# Altium schematic sheet MCU.SchDoc
size A3
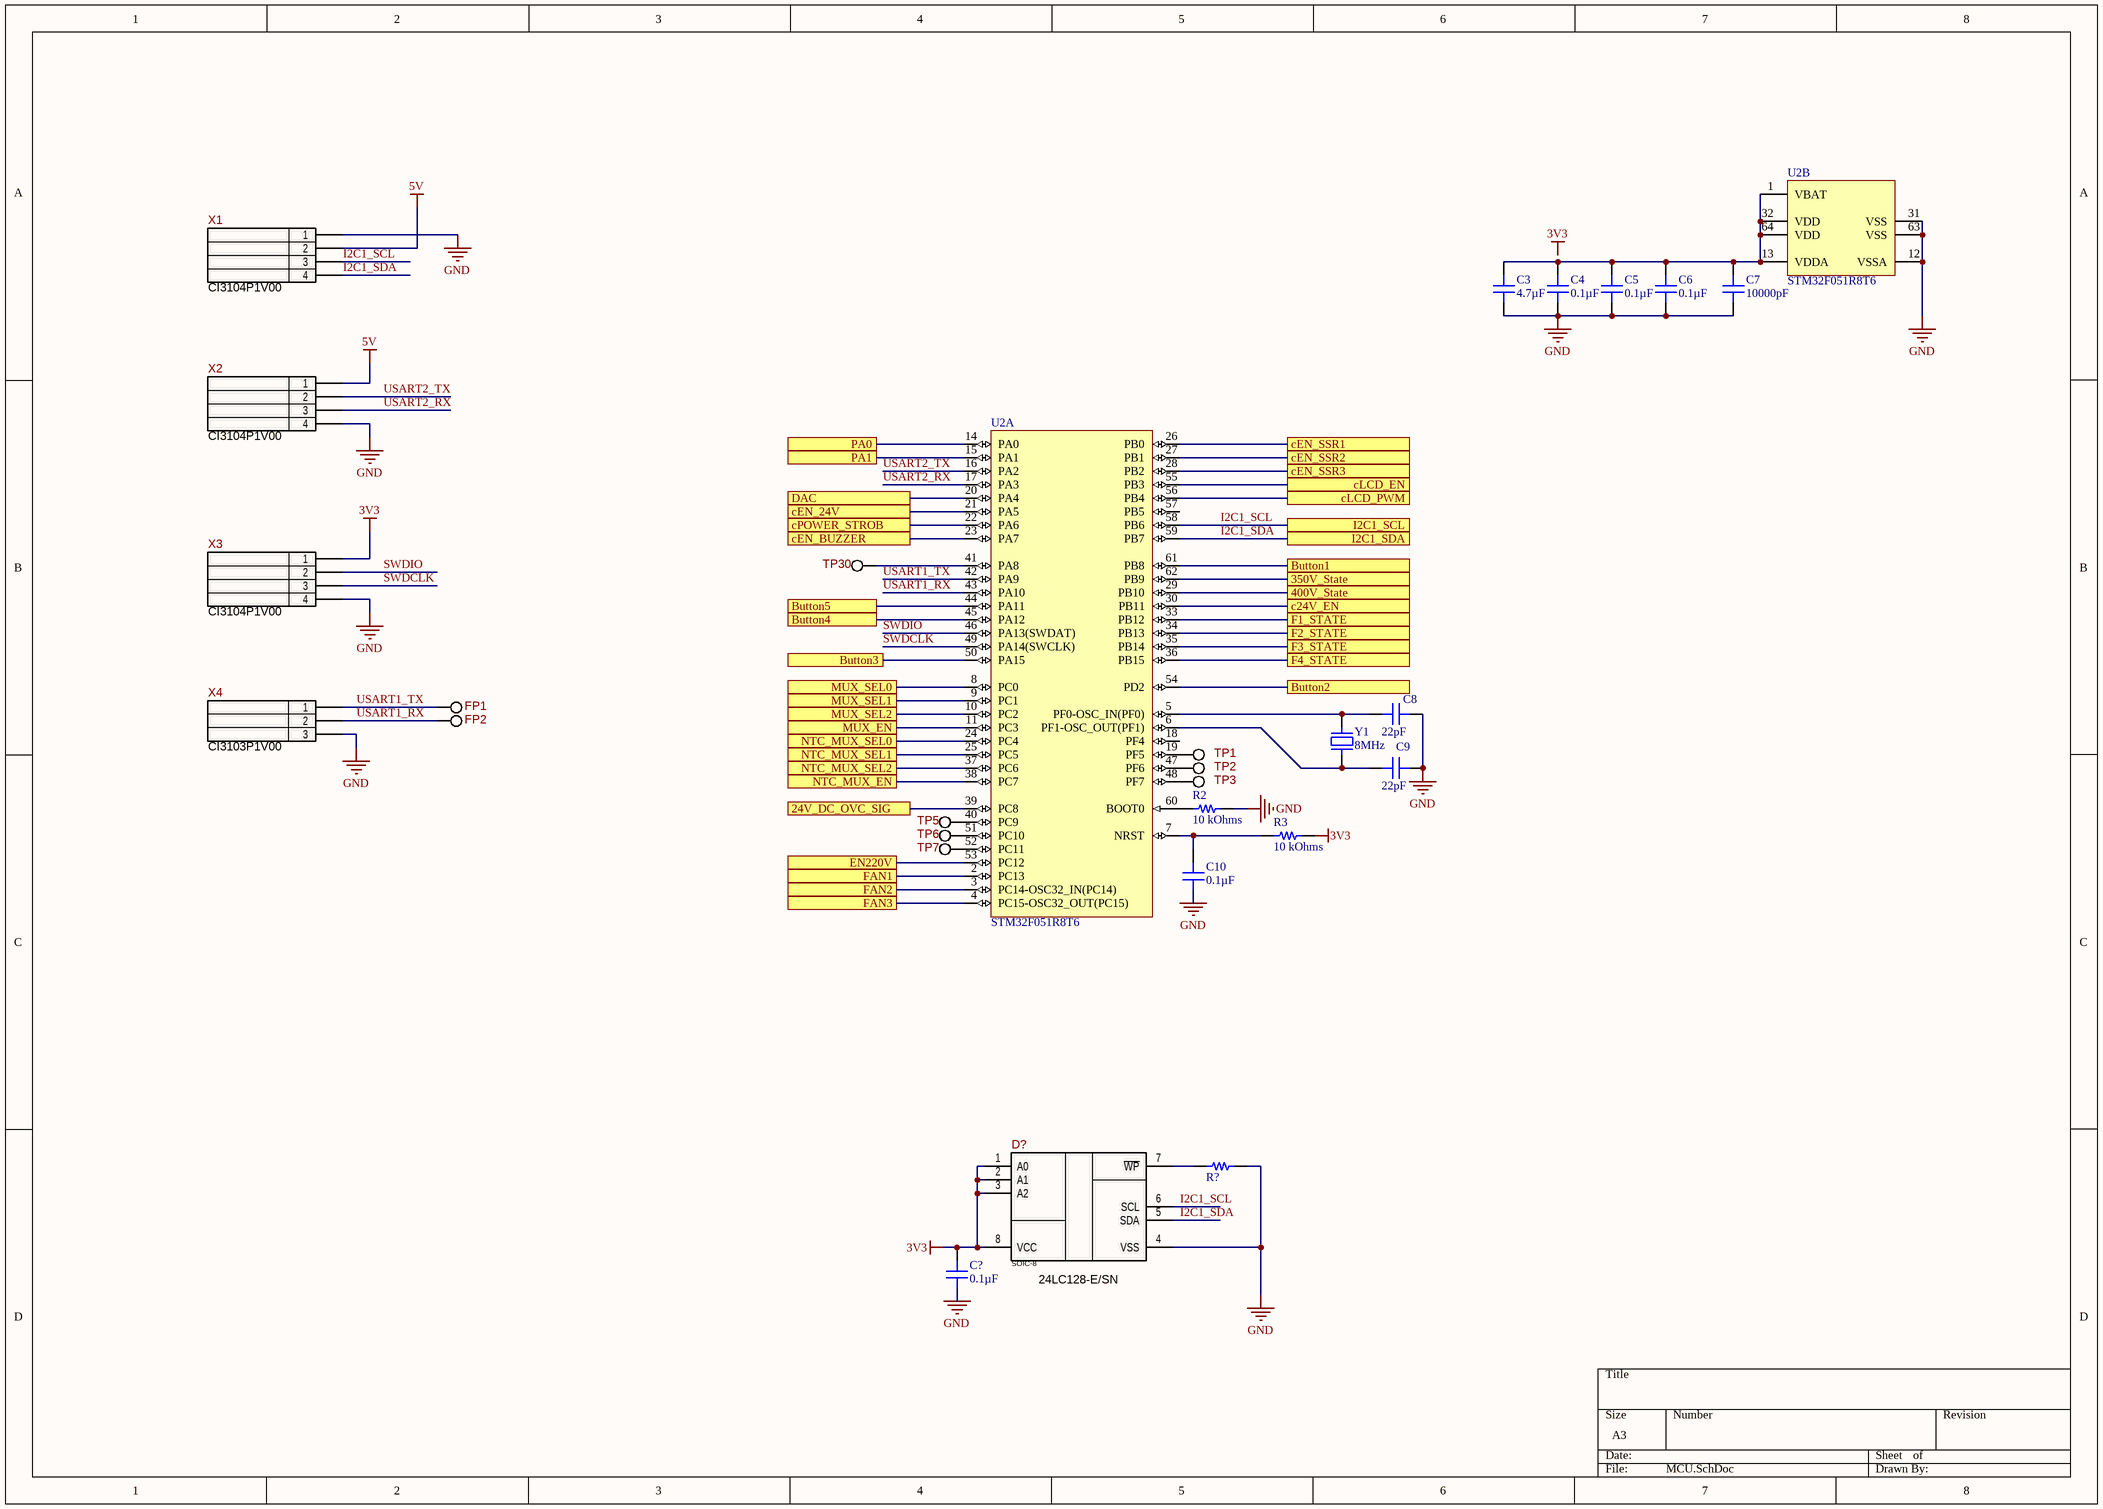
[diagram p0: MCU.SchDoc]

## Parts
C3  4.7µF  [CAP 0805_2012]
C4  0.1µF  [CAP 0805_2012]
C5  0.1µF  [CAP 0805_2012]
C6  0.1µF  [CAP 0805_2012]
C7  10000pF  [CAP 0805_2012]
C8  22pF  [CAP 0805_2012]
C9  22pF  [CAP 0805_2012]
C10  0.1µF  [CAP 0805_2012]
C?  0.1µF  [CAP 0805_2012]
D?  Package: SOIC-8  [SOIC-8_W3.9MM]  (hidden comment: 24LC128-E/SN)
FP1  PAD-1.1mm  [PAD-1.1mm]  (value not drawn)  (no BOM)
FP2  PAD-1.1mm  [PAD-1.1mm]  (value not drawn)  (no BOM)
R2  10 kOhms  [RES 0805_2012]
R3  10 kOhms  [RES 0805_2012]
R?  (no value)  [RES 0805_2012]
TP1  PAD-1.1mm  [PAD-1.1mm]  (value not drawn)  (no BOM)
TP2  PAD-1.1mm  [PAD-1.1mm]  (value not drawn)  (no BOM)
TP3  PAD-1.1mm  [PAD-1.1mm]  (value not drawn)  (no BOM)
TP5  PAD-1.1mm  [PAD-1.1mm]  (value not drawn)  (no BOM)
TP6  PAD-1.1mm  [PAD-1.1mm]  (value not drawn)  (no BOM)
TP7  PAD-1.1mm  [PAD-1.1mm]  (value not drawn)  (no BOM)
TP30  PAD-1.1mm  [PAD-1.1mm]  (value not drawn)  (no BOM)
U2  STM32F051R8T6  [STM-LQFP64_L]  (parts A,B of 2)
X1  WH-04S  [WF-4S]  (value not drawn)
X2  WH-04S  [WF-4S]  (value not drawn)
X3  WH-04S  [WF-4S]  (value not drawn)
X4  WH-03S  [WF-3S]  (value not drawn)
Y1  8MHz  [ABRACON ABLS]

## Ports
24V_DC_OVC_SIG, 350V_State, 400V_State, Button1, Button2, Button3, Button4, Button5, c24V_EN, cEN_24V, cEN_BUZZER, cEN_SSR1, cEN_SSR2, cEN_SSR3, cLCD_EN, cLCD_PWM, cPOWER_STROB, DAC, EN220V, F1_STATE, F2_STATE, F3_STATE, F4_STATE, FAN1, FAN2, FAN3, I2C1_SCL, I2C1_SDA, MUX_EN, MUX_SEL0, MUX_SEL1, MUX_SEL2, NTC_MUX_EN, NTC_MUX_SEL0, NTC_MUX_SEL1, NTC_MUX_SEL2, PA0, PA1

## Nets
3V3: C?.1 D?.1(A0) D?.2(A1) D?.3(A2) D?.8(VCC) R3.2 X3.1
5V: X1.2 X2.1
GND: C3.1 C4.1 C5.1 C6.1 C7.1 C8.2 C9.2 C10.1 C?.2 D?.4(VSS) R2.2 R?.2 U2.12(VSSA) U2.31(VSS) U2.63(VSS) X1.1 X2.4 X3.4 X4.3
24V_DC_OVC_SIG: U2.39(PC8) ; port 24V_DC_OVC_SIG
350V_State: U2.62(PB9) ; port 350V_State
400V_State: U2.29(PB10) ; port 400V_State
Button1: U2.61(PB8) ; port Button1
Button2: U2.54(PD2) ; port Button2
Button3: U2.50(PA15) ; port Button3
Button4: U2.45(PA12) ; port Button4
Button5: U2.44(PA11) ; port Button5
c24V_EN: U2.30(PB11) ; port c24V_EN
cEN_24V: U2.21(PA5) ; port cEN_24V
cEN_BUZZER: U2.23(PA7) ; port cEN_BUZZER
cEN_SSR1: U2.26(PB0) ; port cEN_SSR1
cEN_SSR2: U2.27(PB1) ; port cEN_SSR2
cEN_SSR3: U2.28(PB2) ; port cEN_SSR3
cLCD_EN: U2.55(PB3) ; port cLCD_EN
cLCD_PWM: U2.56(PB4) ; port cLCD_PWM
cPOWER_STROB: U2.22(PA6) ; port cPOWER_STROB
DAC: U2.20(PA4) ; port DAC
EN220V: U2.53(PC12) ; port EN220V
F1_STATE: U2.33(PB12) ; port F1_STATE
F2_STATE: U2.34(PB13) ; port F2_STATE
F3_STATE: U2.35(PB14) ; port F3_STATE
F4_STATE: U2.36(PB15) ; port F4_STATE
FAN1: U2.2(PC13) ; port FAN1
FAN2: U2.3(PC14-OSC32_IN(PC14)) ; port FAN2
FAN3: U2.4(PC15-OSC32_OUT(PC15)) ; port FAN3
I2C1_SCL: D?.6(SCL) U2.58(PB6) X1.3 ; port I2C1_SCL
I2C1_SDA: D?.5(SDA) U2.59(PB7) X1.4 ; port I2C1_SDA
MUX_EN: U2.11(PC3) ; port MUX_EN
MUX_SEL0: U2.8(PC0) ; port MUX_SEL0
MUX_SEL1: U2.9(PC1) ; port MUX_SEL1
MUX_SEL2: U2.10(PC2) ; port MUX_SEL2
NTC_MUX_EN: U2.38(PC7) ; port NTC_MUX_EN
NTC_MUX_SEL0: U2.24(PC4) ; port NTC_MUX_SEL0
NTC_MUX_SEL1: U2.25(PC5) ; port NTC_MUX_SEL1
NTC_MUX_SEL2: U2.37(PC6) ; port NTC_MUX_SEL2
PA0: U2.14(PA0) ; port PA0
PA1: U2.15(PA1) ; port PA1
SWDCLK: U2.49(PA14(SWCLK)) X3.3
SWDIO: U2.46(PA13(SWDAT)) X3.2
USART1_RX: FP2.1 U2.43(PA10) X4.2
USART1_TX: FP1.1 U2.42(PA9) X4.1
USART2_RX: U2.17(PA3) X2.3
USART2_TX: U2.16(PA2) X2.2
NetC3_2: C3.2 C4.2 C5.2 C6.2 C7.2 U2.1(VBAT) U2.13(VDDA) U2.32(VDD) U2.64(VDD)
NetC8_1: C8.1 U2.5(PF0-OSC_IN(PF0)) Y1.2
NetC9_1: C9.1 U2.6(PF1-OSC_OUT(PF1)) Y1.1
NetC10_2: C10.2 R3.1 U2.7(NRST)
NetD?_7: D?.7(~{WP}) R?.1
NetR2_1: R2.1 U2.60(BOOT0)
NetTP1_1: TP1.1 U2.19(PF5)
NetTP2_1: TP2.1 U2.47(PF6)
NetTP3_1: TP3.1 U2.48(PF7)
NetTP5_1: TP5.1 U2.40(PC9)
NetTP6_1: TP6.1 U2.51(PC10)
NetTP7_1: TP7.1 U2.52(PC11)
NetTP30_1: TP30.1 U2.41(PA8)

Not connected (* = marked no-connect by the designer): U2 18(PF4) 57(PB5)

## Notes on the sheet
- Labels drawn without touching a wire or pin: 3V3

## Library data of the parts
C3 = CGA4J1X8L1C475K125AC: CAP CER X8L 16V 4.7UF 10% 1.25MM; Manufacturer: TDK Corporation; Part Number: CGA4J1X8L1C475K125AC; Value: 4.7µF; Applications: Automotive; Capacitance: 4.7µF; ComponentLink1Description: Datasheet; ComponentLink1URL: https://product.tdk.com/info/en/catalog/datasheets/mlcc_automotive_hightemp_en.pdf?ref_disty=digikey; ComponentLink2Description: DigiKey Link; ComponentLink2URL: http://digikey.com/product-detail/en/tdk-corporation/CGA4J1X8L1C475K125AC/445-175266-1-ND/7930961; Device Package: 0805 (2012 Metric); Features: High Temperature; LastUpdated: 02.09.2020 01:04:37; Lifecycle Status: Active; Minimum Order: 1; Mounting Type: Surface Mount, MLCC; Operating Temperature: -55°C ~ 150°C; Package / Case: 0805 (2012 Metric); Packaging: TapeAndReel; PartId: 5098; Part Status: Active; Price: 0.14; Ratings: AEC-Q200; Series: CGA; Size / Dimension: 0.079" L x 0.049" W (2.00mm x 1.25mm); Supplier 1: DigiKey; Supplier Part Number 1: 445-175266-1-ND; Temperature Coefficient: X8L; Thickness (Max): 0.057" (1.45mm); Tolerance: ±10%; Voltage - Rated: 16V
C4-C6 C10 C? = CC0805MRX7R9BB104: CAP CER 0.1UF 50V X7R 0805; Manufacturer: Yageo; Tolerance: ±20%; Part Number: CC0805MRX7R9BB104; Value: 0.1µF; Applications: General Purpose; Capacitance: 0.1µF; ComponentLink1Description: Datasheet; ComponentLink1URL: https://www.yageo.com/upload/media/product/productsearch/datasheet/mlcc/UPY-GPHC_X7R_6.3V-to-50V_18.pdf; ComponentLink2Description: DigiKey Link; ComponentLink2URL: http://digikey.com/product-detail/en/yageo/CC0805MRX7R9BB104/311-4351-1-ND/8025440; Device Package: 0805 (2012 Metric); LastUpdated: 02.09.2020 01:04:42; Lifecycle Status: Active; Minimum Order: 1; Mounting Type: Surface Mount, MLCC; Operating Temperature: -55°C ~ 125°C; Package / Case: 0805 (2012 Metric); Packaging: TapeAndReel; PartId: 2475; Part Status: Active; Price: 0.02; Series: CC; Size / Dimension: 0.079" L x 0.049" W (2.00mm x 1.25mm); Supplier 1: DigiKey; Supplier Part Number 1: 311-4351-1-ND; Temperature Coefficient: X7R; Thickness (Max): 0.037" (0.95mm); Voltage - Rated: 50V
C7 = C0805C103K5RECAUTO: CAP CER 0805 10NF 50V X7R 10%; Manufacturer: KEMET; Part Number: C0805C103K5RECAUTO; Value: 10000pF; Applications: Automotive, ESD Protection; Capacitance: 10000pF; ComponentLink1Description: Datasheet; ComponentLink1URL: https://api.kemet.com/component-edge/download/datasheet/C0805C103K5RECAUTO.pdf; ComponentLink2Description: DigiKey Link; ComponentLink2URL: http://digikey.com/product-detail/en/kemet/C0805C103K5RECAUTO/399-17885-1-ND/8640552; Device Package: 0805 (2012 Metric); LastUpdated: 02.09.2020 01:04:31; Lifecycle Status: Active; Minimum Order: 1; Mounting Type: Surface Mount, MLCC; Operating Temperature: -55°C ~ 125°C; Package / Case: 0805 (2012 Metric); Packaging: TapeAndReel; PartId: 8498; Part Status: Active; Price: 0.05; Ratings: AEC-Q200; Series: ESD SMD Auto X7R; Size / Dimension: 0.079" L x 0.049" W (2.00mm x 1.25mm); Supplier 1: DigiKey; Supplier Part Number 1: 399-17885-1-ND; Temperature Coefficient: X7R; Thickness (Max): 0.035" (0.88mm); Tolerance: ±10%; Voltage - Rated: 50V
C8 C9 = C0805C220J5GACAUTO: CAP CER 22PF 50V C0G/NP0 0805; Manufacturer: KEMET; Temperature Coefficient: C0G, NP0; Tolerance: ±5%; Part Number: C0805C220J5GACAUTO; Value: 22pF; Applications: Automotive; Capacitance: 22pF; ComponentLink1Description: Datasheet; ComponentLink1URL: https://api.kemet.com/component-edge/download/datasheet/C0805C220J5GACAUTO.pdf; ComponentLink2Description: DigiKey Link; ComponentLink2URL: http://digikey.com/product-detail/en/kemet/C0805C220J5GACAUTO/399-6937-1-ND/3314446; Device Package: 0805 (2012 Metric); Features: Low ESL; LastUpdated: 02.09.2020 01:04:42; Lifecycle Status: Active; Minimum Order: 1; Mounting Type: Surface Mount, MLCC; Operating Temperature: -55°C ~ 125°C; Package / Case: 0805 (2012 Metric); Packaging: TapeAndReel; PartId: 2537; Part Status: Active; Price: 0.02; Ratings: AEC-Q200; Series: SMD Auto C0G; Size / Dimension: 0.079" L x 0.049" W (2.00mm x 1.25mm); Supplier 1: DigiKey; Supplier Part Number 1: 399-6937-1-ND; Thickness (Max): 0.035" (0.88mm); Voltage - Rated: 50V
D? = 24LC128-E/SN: EEPROM Memory IC 128Kb (16K x 8) I2C 400kHz 900ns SOIC-8; Manufacturer: Microchip Technology; Ajax_1C_ID: 10590; Ajax_1C_PN: 24LC128-E/SN SO8; Ajax_1С_Status: RND Only; Standard Lead Time: 6 Weeks; Component Status: On Review; Replacement: NONE; GUID_1C: 19c1e12f-7c36-11e7-813c-14dda9d2d04d; Part Type: Memory / EEPROM; Component Type: SMD; Temperature Range: -40°C ~ 125°C; ComponentLink1URL: http://www.microchip.com/mymicrochip/filehandler.aspx?ddocname=en011851; Supplier 1: Mouser; Supplier Part Number 1: 579-24LC128-E/SN; Price: 0,94; ComponentLink1Description: Datasheet; Part Number: 24LC128-E/SN
FP1 FP2 = PAD-1.1mm: 1.1mm Pad for Plug-In or Receptacle; Ajax_1C_PN: NONE; Part Number: PAD-1.1mm; Component Type: PTH; Lifecycle: RND Only; Manufacturer: NONE; Part Type: Pad; Temperature Range: NONE; ComponentLink1URL: NONE; Replacement: NONE; ComponentLink1Description: Datasheet
R2 R3 = RNCS0805BKE10K0: RES 10K OHM 0.1% 1/10W 0805; Manufacturer: Stackpole Electronics Inc; Power (Watts): 0.1W, 1/10W; Temperature Coefficient: ±25ppm/°C; Part Number: RNCS0805BKE10K0; Value: 10 kOhms; ComponentLink1Description: Datasheet; ComponentLink1URL: https://www.seielect.com/catalog/sei-rncs_rnch.pdf; ComponentLink2Description: DigiKey Link; ComponentLink2URL: http://digikey.com/product-detail/en/stackpole-electronics-inc/RNCS0805BKE10K0/RNCS0805BKE10K0CT-ND/1800164; Composition: Thin Film; Device Package: 0805 (2012 Metric); Features: Anti-Corrosive, Automotive AEC-Q200, Moisture Resistant; Height - Seated (Max): 0.026" (0.65mm); LastUpdated: 02.09.2020 01:15:24; Lifecycle Status: Active; Minimum Order: 1; Number of Terminations: 2; Operating Temperature: -55°C ~ 155°C; Package / Case: 0805 (2012 Metric); Packaging: TapeAndReel; PartId: 27713; Part Status: Active; Price: 0.09; Ratings: AEC-Q200; Resistance: 10 kOhms; Series: RNCS; Size / Dimension: 0.079" L x 0.049" W (2.00mm x 1.25mm); Supplier 1: DigiKey; Supplier Part Number 1: RNCS0805BKE10K0CT-ND; Supplier Device Package: 0805; Tolerance: ±0.1%
R? = TLRZ2ATTD: RES 0 OHM JUMPER 0805; Manufacturer: KOA Speer Electronics, Inc.; Part Number: TLRZ2ATTD; ComponentLink1Description: Datasheet; ComponentLink1URL: http://www.koaspeer.com/catimages/Products/TLRZ/TLRZ.pdf; ComponentLink2Description: DigiKey Link; ComponentLink2URL: http://digikey.com/product-detail/en/koa-speer-electronics-inc/TLRZ2ATTD/2019-TLRZ2ATTDCT-ND/9847538; Composition: Metal Element; Device Package: 0805 (2012 Metric); Features: Automotive AEC-Q200, Current Sense; Height - Seated (Max): 0.022" (0.55mm); LastUpdated: 02.09.2020 01:15:24; Lifecycle Status: Active; Minimum Order: 1; Number of Terminations: 2; Operating Temperature: -55°C ~ 170°C; Package / Case: 0805 (2012 Metric); Packaging: TapeAndReel; PartId: 27685; Part Status: Active; Price: 0.09; Ratings: AEC-Q200; Series: TLRZ; Size / Dimension: 0.079" L x 0.049" W (2.00mm x 1.25mm); Supplier 1: DigiKey; Supplier Part Number 1: 2019-TLRZ2ATTDCT-ND; Supplier Device Package: 0805; Tolerance: Jumper
TP1-TP3 TP5-TP7 TP30 = PAD-1.1mm: 1.1mm Pad for Plug-In or Receptacle; Ajax_1C_PN: NONE; Ajax_1С_Status: RND Only; Component Status: Released; Lifecycle: ="Lifecycle"; Part Number: PAD-1.1mm; Component Type: PTH; Manufacturer: NONE; Part Type: Pad; Temperature Range: NONE; ComponentLink1URL: NONE; Replacement: NONE; Price: NONE; ComponentLink1Description: Datasheet
U2 = STM32F051R8T6: ARM Cortex-M0 32-bit MCU, 64 KB Flash, 8 KB Internal RAM, 55 I/Os, 64-pin LQFP, -40 to 85 degC, Tray; FLASH Size (Prog) (kB): 64; I/Os (High Current): 55; Internal RAM Size (kB): 8; Operating Frequency(F) (Processor speed) (MHz): 48; Supply Voltage(Vcc) min (V): 2; DatasheetVersion: Rev. 3; PackageVersion: Rev. 4, 06/2013; PackageReference: LQFP64; PackageDescription: 64-Pin Low Profile Quad Flat Package, 10 x 10 mm Body, 0.5 mm Pitch; Supplier 1: Digi-Key; Supplier Part Number 1: 497-12891-ND; Supplier 2: Farnell; Supplier Part Number 2: 2115071; Supplier 3: Newark; Supplier Part Number 3: 05W5808; Supplier 4: Mouser; Supplier Part Number 4: 511-STM32F051R8T6; Core: ARM Cortex-M0; Packing: Tray; Mounting Technology: Surface Mount; PartNumber: STM32F051R8T6; ComponentLink1Description: Manufacturer URL; ComponentLink1URL: http://www.st.com/web/en/home.html; ComponentLink2Description: Datasheet; ComponentLink2URL: http://www.st.com/st-web-ui/static/active/en/resource/technical/document/datasheet/DM00039193.pdf; ComponentLink3Description: Package Specification; ComponentLink3URL: http://www.st.com/st-web-ui/static/active/en/resource/technical/document/datasheet/DM00037051.pdf
X1-X3 = CI3104P1V00: WH Series 2.54mm Wire to Board Straight DIP Type Headers, 4 Pin; Manufacturer: CviLux; Ajax_1C_ID: 1232; Ajax_1C_PN: WF-04S, разъем 4 пина "папа", на плату; Ajax_1С_Status: RND Only; Component Status: Released; Replacement: NONE; GUID_1C: 2c368b74-dd41-11e0-af93-6c626deda1bb; System: Connector; Part Number: CI3104P1V00; Part Type: Wire-to-Board / Header; Component Type: PTH; Temperature Range: -25℃ ~ 85℃; ComponentLink1URL: https://www.cvilux.com/uploads/drawings/100/723/CI3102S.pdf; Price: 0,06818182; ComponentLink1Description: Datasheet
X4 = CI3103P1V00: WH Series 2.54mm Wire to Board Straight DIP Type Headers, 3-Pin; Manufacturer: CviLux; Ajax_1C_ID: 6819; Ajax_1C_PN: WF-03S (KLS1-2.54-03S); Штекер "папа"; 3 контакта; шаг 2.54мм; прямой; на плату; Ajax_1С_Status: RND Only; Component Status: Released; Replacement: NONE; GUID_1C: c0930565-35d6-11e5-ad28-a45d36c4a9e5; System: Connector; Part Number: CI3103P1V00; Part Type: Wire-to-Board / Header; Component Type: PTH; Temperature Range: -25℃ ~ 85℃; ComponentLink1URL: https://www.cvilux.com/uploads/drawings/100/723/CI3102S.pdf; Price: 0,016; ComponentLink1Description: Datasheet
Y1 = ABLS-8.000MHZ-SD7Y-T: CRYSTAL 8.000MHZ 18PF SMD; Manufacturer: Abracon LLC; ESR (Equivalent Series Resistance): 80 Ohms; Frequency Stability: ±30ppm; Frequency Tolerance: ±15ppm; Operating Mode: Fundamental; Part Number: ABLS-8.000MHZ-SD7Y-T; ComponentLink1Description: Datasheet; ComponentLink1URL: https://abracon.com/Resonators/abls.pdf; ComponentLink2Description: DigiKey Link; ComponentLink2URL: http://digikey.com/product-detail/en/abracon-llc/ABLS-8.000MHZ-SD7Y-T/535-14365-1-ND/8582126; Frequency: 8MHz; Height - Seated (Max): 0.165" (4.20mm); LastUpdated: 02.09.2020 01:21:46; Lifecycle Status: Active; Load Capacitance: 18pF; Minimum Order: 1; Mounting Type: Surface Mount; Operating Temperature: -40°C ~ 85°C; Package / Case: HC-49/US; Packaging: TapeAndReel; PartId: 25; Part Status: Active; Price: 0.24; Series: ABLS; Size / Dimension: 0.449" L x 0.185" W (11.40mm x 4.70mm); Supplier 1: DigiKey; Supplier Part Number 1: 535-14365-1-ND; Type: MHz Crystal; Value: 8MHz